# Altium project mini_backplane.PrjPcb
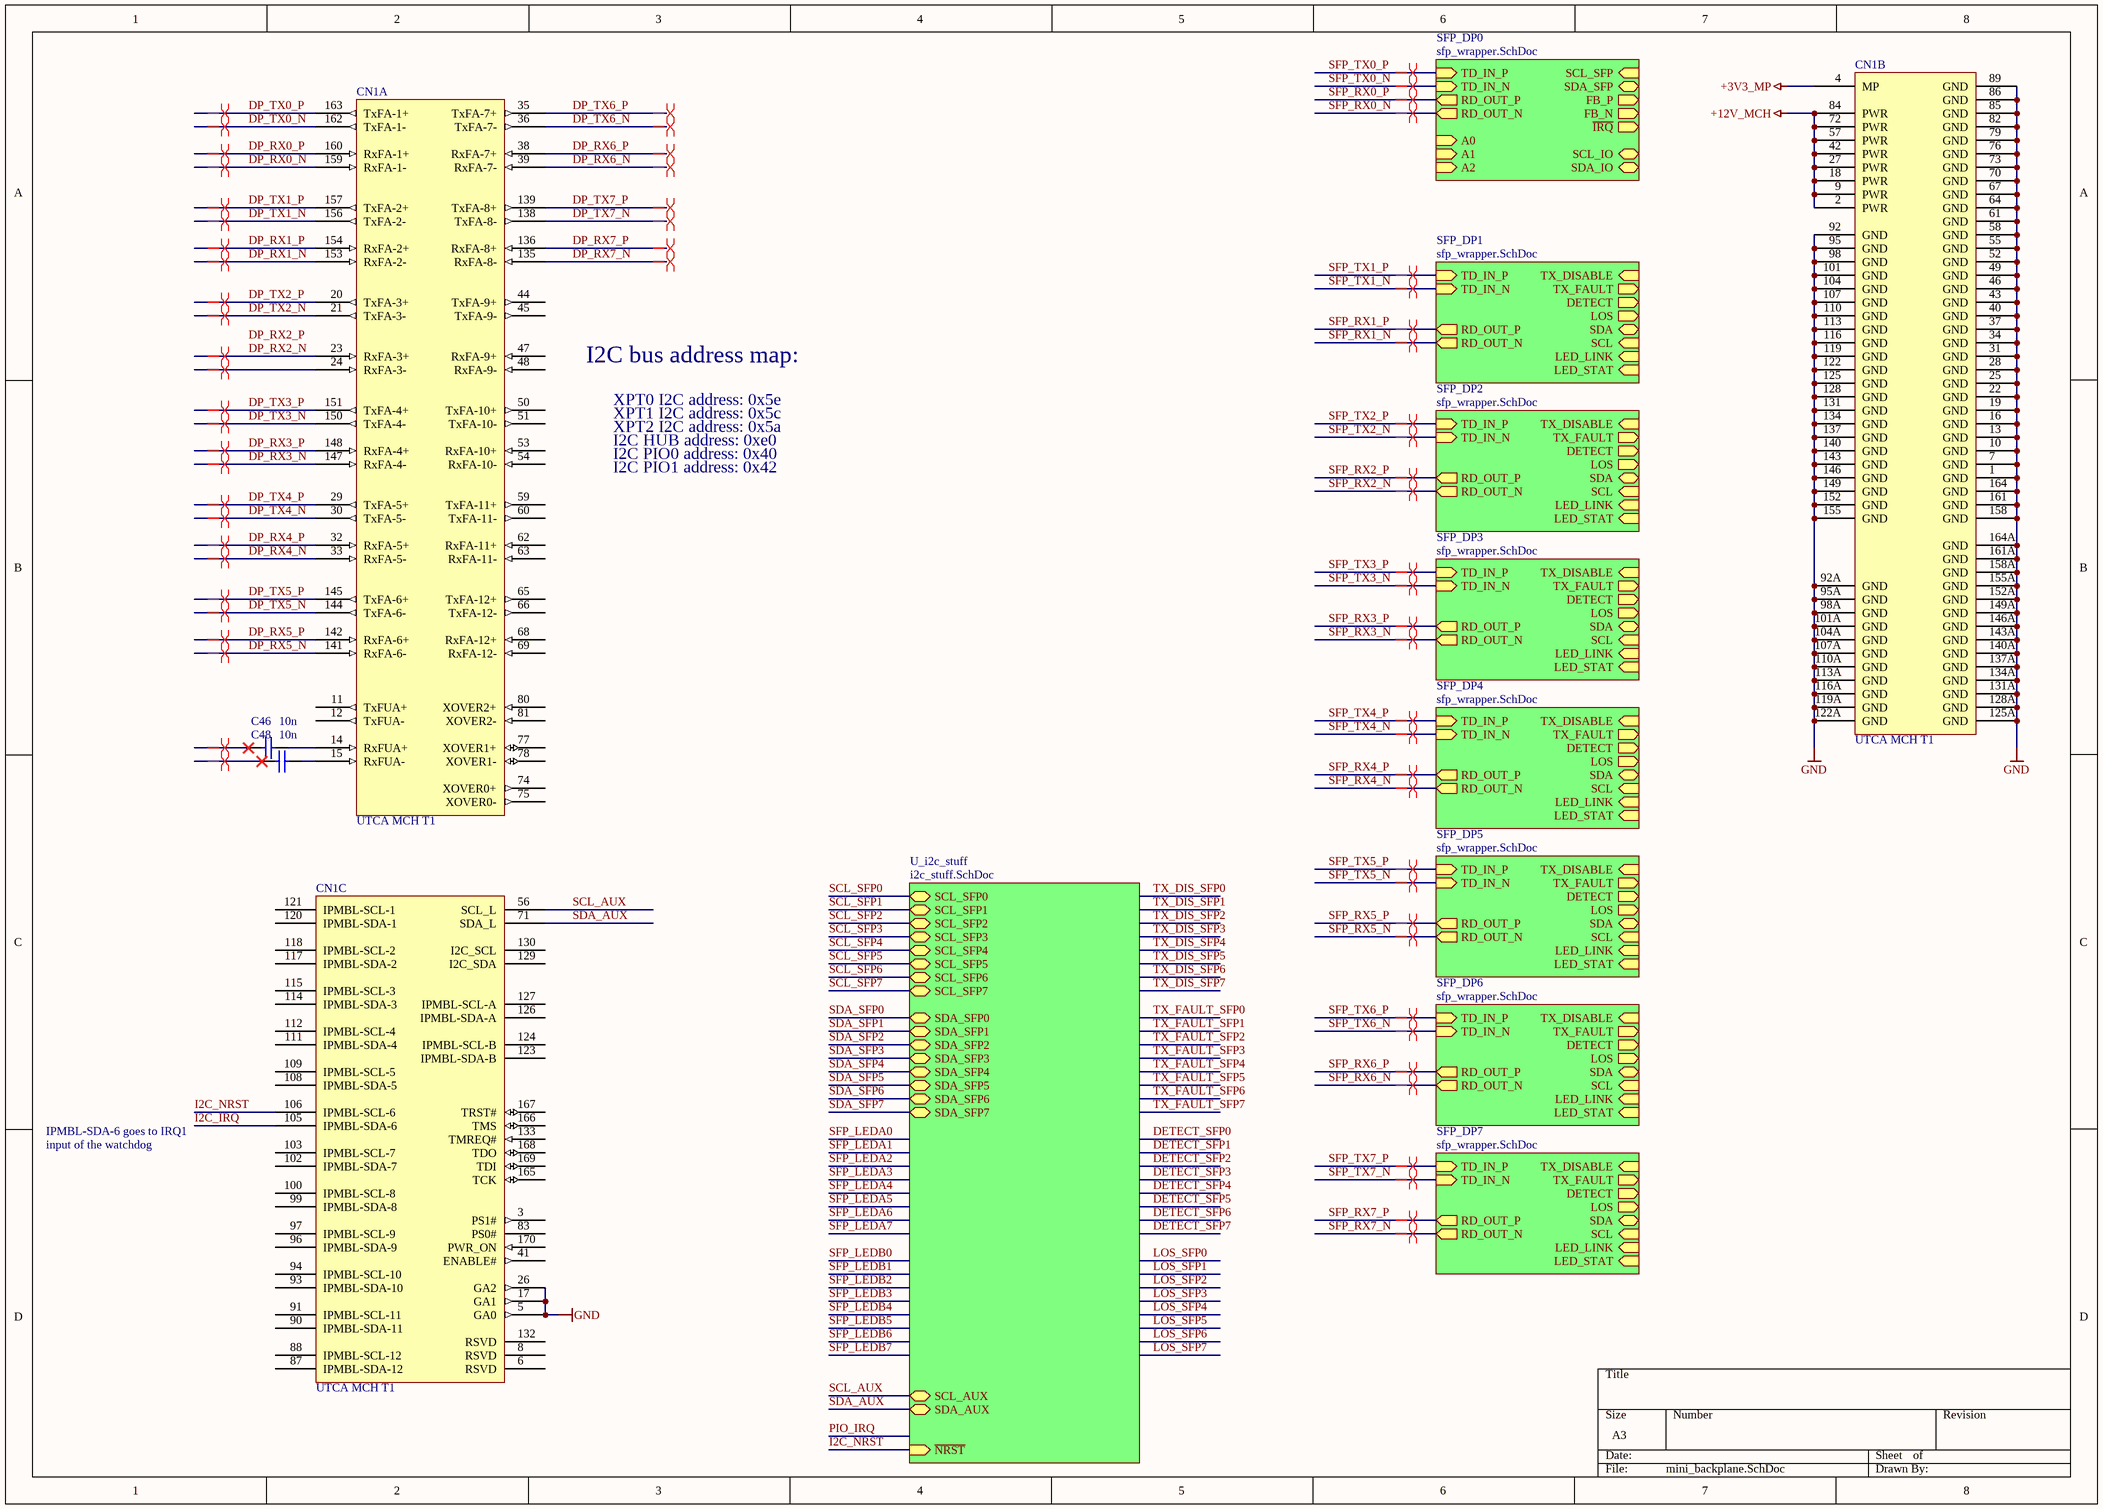
[diagram p0: mini_backplane.SchDoc]
4 sheets, 284 parts. Net scope: hierarchical (ports join the sheet entries above them; power ports are global).
Board file: mini_backplane.PcbDoc
Sheets:
  mini_backplane.SchDoc
    SFP_DP0 = sfp_wrapper.SchDoc
    SFP_DP1 = sfp_wrapper.SchDoc
    SFP_DP2 = sfp_wrapper.SchDoc
    SFP_DP3 = sfp_wrapper.SchDoc
    SFP_DP4 = sfp_wrapper.SchDoc
    SFP_DP5 = sfp_wrapper.SchDoc
    SFP_DP6 = sfp_wrapper.SchDoc
    SFP_DP7 = sfp_wrapper.SchDoc
    U_i2c_stuff = i2c_stuff.SchDoc
  xpoint.SchDoc

## Sheet mini_backplane.SchDoc
size A3

### Parts
C46  10n  [CAPC1608X87N]
C48  10n  [CAPC1608X87N]
CN1  UTCA MCH T1  [CON_AMC_MOLEX_75800_00001_REVERSE]  (parts A,B,C of 3)

### Sub-sheets
SFP_DP0 = sfp_wrapper.SchDoc: RD_OUT_N (out), RD_OUT_P (out), TD_IN_N (in), TD_IN_P (in), SDA_SFP (bidir), SCL_SFP (in), FB_P (out), FB_N (out), ~{IRQ} (out), A0 (in), A1 (in), A2 (in), SCL_IO (bidir), SDA_IO (bidir)
SFP_DP1 = sfp_wrapper.SchDoc: TX_FAULT (out), TX_DISABLE (in), SDA (bidir), SCL (in), DETECT (out), LOS (out), RD_OUT_N (out), RD_OUT_P (out), TD_IN_N (in), TD_IN_P (in), LED_LINK (in), LED_STAT (in)
SFP_DP2 = sfp_wrapper.SchDoc: TX_FAULT (out), TX_DISABLE (in), SDA (bidir), SCL (in), DETECT (out), LOS (out), RD_OUT_N (out), RD_OUT_P (out), TD_IN_N (in), TD_IN_P (in), LED_LINK (in), LED_STAT (in)
SFP_DP3 = sfp_wrapper.SchDoc: TX_FAULT (out), TX_DISABLE (in), SDA (bidir), SCL (in), DETECT (out), LOS (out), RD_OUT_N (out), RD_OUT_P (out), TD_IN_N (in), TD_IN_P (in), LED_LINK (in), LED_STAT (in)
SFP_DP4 = sfp_wrapper.SchDoc: TX_FAULT (out), TX_DISABLE (in), SDA (bidir), SCL (in), DETECT (out), LOS (out), RD_OUT_N (out), RD_OUT_P (out), TD_IN_N (in), TD_IN_P (in), LED_LINK (in), LED_STAT (in)
SFP_DP5 = sfp_wrapper.SchDoc: TX_FAULT (out), TX_DISABLE (in), SDA (bidir), SCL (in), DETECT (out), LOS (out), RD_OUT_N (out), RD_OUT_P (out), TD_IN_N (in), TD_IN_P (in), LED_LINK (in), LED_STAT (in)
SFP_DP6 = sfp_wrapper.SchDoc: TX_FAULT (out), TX_DISABLE (in), SDA (bidir), SCL (in), DETECT (out), LOS (out), RD_OUT_N (out), RD_OUT_P (out), TD_IN_N (in), TD_IN_P (in), LED_LINK (in), LED_STAT (in)
SFP_DP7 = sfp_wrapper.SchDoc: TX_FAULT (out), TX_DISABLE (in), SDA (bidir), SCL (in), DETECT (out), LOS (out), RD_OUT_N (out), RD_OUT_P (out), TD_IN_N (in), TD_IN_P (in), LED_LINK (in), LED_STAT (in)
U_i2c_stuff = i2c_stuff.SchDoc: SCL_SFP0 (bidir), SCL_SFP1 (bidir), SCL_SFP2 (bidir), SCL_SFP3 (bidir), SCL_SFP4 (bidir), SCL_SFP5 (bidir), SCL_SFP6 (bidir), SCL_SFP7 (bidir), SDA_SFP0 (bidir), SDA_SFP1 (bidir), SDA_SFP2 (bidir), SDA_SFP3 (bidir), SDA_SFP4 (bidir), SDA_SFP5 (bidir), SDA_SFP6 (bidir), SDA_SFP7 (bidir), SCL_AUX (bidir), SDA_AUX (bidir), ~{NRST} (in)

### Nets
+3V3_MP: CN1.4(MP)
+12V_MCH: CN1.2(PWR) CN1.9(PWR) CN1.18(PWR) CN1.27(PWR) CN1.42(PWR) CN1.57(PWR) CN1.72(PWR) CN1.84(PWR)
GND: CN1.1(GND) CN1.5(GA0) CN1.7(GND) CN1.10(GND) CN1.13(GND) CN1.16(GND) CN1.17(GA1) CN1.19(GND) CN1.22(GND) CN1.25(GND) CN1.26(GA2) CN1.28(GND) CN1.31(GND) CN1.34(GND) CN1.37(GND) CN1.40(GND) CN1.43(GND) CN1.46(GND) CN1.49(GND) CN1.52(GND) CN1.55(GND) CN1.58(GND) CN1.61(GND) CN1.64(GND) CN1.67(GND) CN1.70(GND) CN1.73(GND) CN1.76(GND) CN1.79(GND) CN1.82(GND) CN1.85(GND) CN1.86(GND) CN1.89(GND) CN1.92(GND) CN1.92A(GND) CN1.95(GND) CN1.95A(GND) CN1.98(GND) CN1.98A(GND) CN1.101(GND) CN1.101A(GND) CN1.104(GND) CN1.104A(GND) CN1.107(GND) CN1.107A(GND) CN1.110(GND) CN1.110A(GND) CN1.113(GND) CN1.113A(GND) CN1.116(GND) CN1.116A(GND) CN1.119(GND) CN1.119A(GND) CN1.122(GND) CN1.122A(GND) CN1.125(GND) CN1.125A(GND) CN1.128(GND) CN1.128A(GND) CN1.131(GND) CN1.131A(GND) CN1.134(GND) CN1.134A(GND) CN1.137(GND) CN1.137A(GND) CN1.140(GND) CN1.140A(GND) CN1.143(GND) CN1.143A(GND) CN1.146(GND) CN1.146A(GND) CN1.149(GND) CN1.149A(GND) CN1.152(GND) CN1.152A(GND) CN1.155(GND) CN1.155A(GND) CN1.158(GND) CN1.158A(GND) CN1.161(GND) CN1.161A(GND) CN1.164(GND) CN1.164A(GND)
DP_RX0_N: CN1.159(RxFA-1-)
DP_RX0_P: CN1.160(RxFA-1+)
DP_RX1_N: CN1.153(RxFA-2-)
DP_RX1_P: CN1.154(RxFA-2+)
DP_RX2_N: CN1.23(RxFA-3+)
DP_RX3_N: CN1.147(RxFA-4-)
DP_RX3_P: CN1.148(RxFA-4+)
DP_RX4_N: CN1.33(RxFA-5-)
DP_RX4_P: CN1.32(RxFA-5+)
DP_RX5_N: CN1.141(RxFA-6-)
DP_RX5_P: CN1.142(RxFA-6+)
DP_RX6_N: CN1.39(RxFA-7-)
DP_RX6_P: CN1.38(RxFA-7+)
DP_RX7_N: CN1.135(RxFA-8-)
DP_RX7_P: CN1.136(RxFA-8+)
DP_TX0_N: CN1.162(TxFA-1-)
DP_TX0_P: CN1.163(TxFA-1+)
DP_TX1_N: CN1.156(TxFA-2-)
DP_TX1_P: CN1.157(TxFA-2+)
DP_TX2_N: CN1.21(TxFA-3-)
DP_TX2_P: CN1.20(TxFA-3+)
DP_TX3_N: CN1.150(TxFA-4-)
DP_TX3_P: CN1.151(TxFA-4+)
DP_TX4_N: CN1.30(TxFA-5-)
DP_TX4_P: CN1.29(TxFA-5+)
DP_TX5_N: CN1.144(TxFA-6-)
DP_TX5_P: CN1.145(TxFA-6+)
DP_TX6_N: CN1.36(TxFA-7-)
DP_TX6_P: CN1.35(TxFA-7+)
DP_TX7_N: CN1.138(TxFA-8-)
DP_TX7_P: CN1.139(TxFA-8+)
I2C_IRQ: CN1.105(IPMBL-SDA-6)
I2C_NRST: CN1.106(IPMBL-SCL-6) ; sheet U_i2c_stuff/~{NRST}
SCL_AUX: CN1.56(SCL_L) ; sheet U_i2c_stuff/SCL_AUX
SDA_AUX: CN1.71(SDA_L) ; sheet U_i2c_stuff/SDA_AUX
SDA_SFP7: sheet U_i2c_stuff/SDA_SFP7
NetC46_2: C46.2 CN1.14(RxFUA+)
NetC48_2: C48.2 CN1.15(RxFUA-)

Not connected (* = marked no-connect by the designer): C46 1*; C48 1*; CN1 3(PS1#) 6(RSVD) 8(RSVD) 11(TxFUA+) 12(TxFUA-) 24(RxFA-3-) 41(ENABLE#) 44(TxFA-9+) 45(TxFA-9-) 47(RxFA-9+) 48(RxFA-9-) 50(TxFA-10+) 51(TxFA-10-) 53(RxFA-10+) 54(RxFA-10-) 59(TxFA-11+) 60(TxFA-11-) 62(RxFA-11+) 63(RxFA-11-) 65(TxFA-12+) 66(TxFA-12-) 68(RxFA-12+) 69(RxFA-12-) 74(XOVER0+) 75(XOVER0-) 77(XOVER1+) 78(XOVER1-) 80(XOVER2+) 81(XOVER2-) 83(PS0#) 87(IPMBL-SDA-12) 88(IPMBL-SCL-12) 90(IPMBL-SDA-11) 91(IPMBL-SCL-11) 93(IPMBL-SDA-10) 94(IPMBL-SCL-10) 96(IPMBL-SDA-9) 97(IPMBL-SCL-9) 99(IPMBL-SDA-8) 100(IPMBL-SCL-8) 102(IPMBL-SDA-7) 103(IPMBL-SCL-7) 108(IPMBL-SDA-5) 109(IPMBL-SCL-5) 111(IPMBL-SDA-4) 112(IPMBL-SCL-4) 114(IPMBL-SDA-3) 115(IPMBL-SCL-3) 117(IPMBL-SDA-2) 118(IPMBL-SCL-2) 120(IPMBL-SDA-1) 121(IPMBL-SCL-1) 123(IPMBL-SDA-B) 124(IPMBL-SCL-B) 126(IPMBL-SDA-A) 127(IPMBL-SCL-A) 129(I2C_SDA) 130(I2C_SCL) 132(RSVD) 133(TMREQ#) 165(TCK) 166(TMS) 167(TRST#) 168(TDO) 169(TDI) 170(PWR_ON)

### Layout directives
differential pair: DP_RX0_N, DP_RX0_P, DP_RX1_N, DP_RX1_P, DP_RX2_N, DP_RX3_N, DP_RX3_P, DP_RX4_N, DP_RX4_P, DP_RX5_N, DP_RX5_P, DP_RX6_N, DP_RX6_P, DP_RX7_N, DP_RX7_P, DP_TX0_N, DP_TX0_P, DP_TX1_N, DP_TX1_P, DP_TX2_N, DP_TX2_P, DP_TX3_N, DP_TX3_P, DP_TX4_N, DP_TX4_P, DP_TX5_N, DP_TX5_P, DP_TX6_N, DP_TX6_P, DP_TX7_N, DP_TX7_P, NetC46_1, NetC48_1, NetCN1_24, RD_OUT_N_SFP_DP0, RD_OUT_N_SFP_DP1, RD_OUT_N_SFP_DP2, RD_OUT_N_SFP_DP3, RD_OUT_N_SFP_DP4, RD_OUT_N_SFP_DP5, RD_OUT_N_SFP_DP6, RD_OUT_N_SFP_DP7, RD_OUT_P_SFP_DP0, RD_OUT_P_SFP_DP1, RD_OUT_P_SFP_DP2, RD_OUT_P_SFP_DP3, RD_OUT_P_SFP_DP4, RD_OUT_P_SFP_DP5, RD_OUT_P_SFP_DP6, RD_OUT_P_SFP_DP7, SFP_TX0_N, SFP_TX0_P, SFP_TX1_N, SFP_TX1_P, SFP_TX2_N, SFP_TX2_P, SFP_TX3_N, SFP_TX3_P, SFP_TX4_N, SFP_TX4_P, SFP_TX5_N, SFP_TX5_P, SFP_TX6_N, SFP_TX6_P, SFP_TX7_N, SFP_TX7_P

### Notes on the sheet
- I2C bus address map:
- XPT0 I2C address: 0x5e
- XPT1 I2C address: 0x5c
- XPT2 I2C address: 0x5a
- I2C HUB address: 0xe0
- I2C PIO0 address: 0x40
- I2C PIO1 address: 0x42
- IPMBL-SDA-6 goes to IRQ1
- input of the watchdog
- Labels drawn without touching a wire or pin: DP_RX2_P

### Library data of the parts
C46 C48 = CC0603_10NF_50V_10%_X7R: Non-polarised capacitor; Part Description: SMD Multilayer Chip Ceramic Capacitor; Manufacturer: GENERIC; Manufacturer1 Part Number: 223858615636; Value: 10nF; Voltage: 50V; TC: X7R; Tolerance: ±10%; Table: Capacitors SMD; Part Number: CC0603_10NF_50V_10%_X7R; Component Kind: Standard; Component Type: Standard; Pin Count: 2; Status: Preferred; Manufacturer Part Number: CC0603_10NF_50V_10%_X7R; Case: 0603; Mounted: Yes; Socket: No; SMD: Yes; Manufacturer1 Example: PHYCOMP; Manufacturer1 ComponentHeight: 0.87mm; HelpURL: \\cern.ch\dfs\Applications\Altium\Datasheets\CC0603_X7R_PHYCOMP.pdf; Author: CERN DEM JLC; CreateDate: 12/3/2007; LatestRevisionDate: 12/3/2007
CN1 = UTCA_MCH_SOCKET: microTCA MTCA.0  MCH socket (AMC0.0 B+ connector with reversed pins); Value: MCH tongue 1; Value: MOLEX 75800-00001; RefId: 1353569; Supplier: Farnell

## Sheet sfp_wrapper.SchDoc
size A4
Used 8 times, as channels SFP_DP0, SFP_DP1, SFP_DP2, SFP_DP3, SFP_DP4, SFP_DP5, SFP_DP6, SFP_DP7. Parts and nets are listed once, with the designators drawn on the sheet.
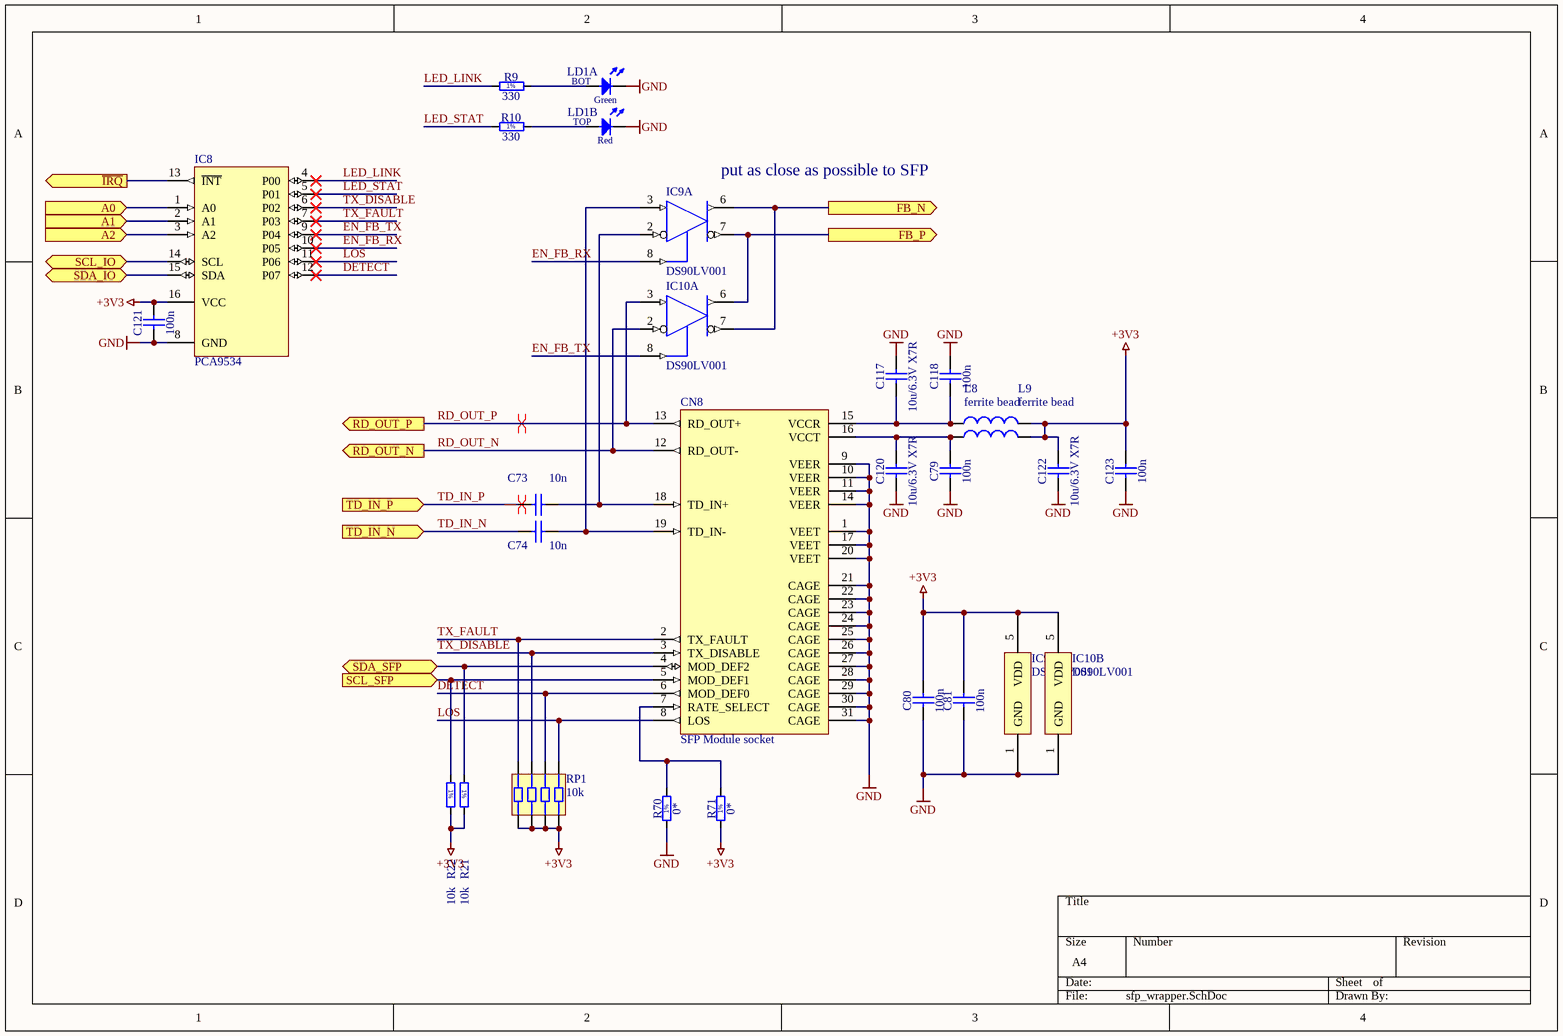
[diagram p1: sfp_wrapper.SchDoc]

### Parts
C73  10n  [CAPC1608X87N]
C74  10n  [CAPC1608X87N]
C79  100n  [CAPC1608X87N]
C80  100n  [CAPC1608X87N]
C81  100n  [CAPC1608X87N]
C117  10u/6.3V X7R  [CAPC3216X140N]
C118  100n  [CAPC1608X87N]
C120  10u/6.3V X7R  [CAPC3216X140N]
C121  100n  [CAPC1608X87N]
C122  10u/6.3V X7R  [CAPC3216X140N]
C123  100n  [CAPC1608X87N]
CN8  SFP Module socket  [SFP_SINGLE_PORT]
IC8  PCA9534  [TSOP65P640-16AM]
IC9  DS90LV001  [SOIC127P600-8AL]  (parts A,B of 2)
IC10  DS90LV001  [SOIC127P600-8AL]  (parts A,B of 2)
L8  value ferrite bead  [INDC2012-0805]  (hidden comment: Inductor)
L9  value ferrite bead  [INDC2012-0805]  (hidden comment: Inductor)
LD1  Red/Green  [LED_DIALIGHT_571-0112-100F]  (value not drawn)  (parts A,B of 2)
R9  330  [RESC1608X55N]
R10  330  [RESC1608X55N]
R21  10k  [RESC1608X55N]
R22  10k  [RESC1608X55N]
R70  0*  [RESC1608X55N]
R71  0*  [RESC1608X55N]
RP1  10k  [CAY-16]

### Ports
A0 (in), A1 (in), A2 (in), FB_N (out), FB_P (out), RD_OUT_N (out), RD_OUT_P (out), SCL_IO (bidir), SCL_SFP (in), SDA_IO (bidir), SDA_SFP (bidir), TD_IN_N (in), TD_IN_P (in), ~{IRQ} (out)

### Nets
+3V3: C80.2 C81.2 C121.2 C122.2 C123.2 IC8.16(VCC) IC9.5(VDD) IC10.5(VDD) L8.2 L9.2 R21.2 R22.2 R71.1 RP1.1 RP1.2 RP1.3 RP1.4
GND: C79.1 C80.1 C81.1 C117.2 C118.2 C120.1 C121.1 C122.1 C123.1 CN8.1(VEET) CN8.9(VEER) CN8.10(VEER) CN8.11(VEER) CN8.14(VEER) CN8.17(VEET) CN8.20(VEET) CN8.21(CAGE) CN8.22(CAGE) CN8.23(CAGE) CN8.24(CAGE) CN8.25(CAGE) CN8.26(CAGE) CN8.27(CAGE) CN8.28(CAGE) CN8.29(CAGE) CN8.30(CAGE) CN8.31(CAGE) IC8.8(GND) IC9.1(GND) IC10.1(GND) LD1.1(C) LD1.3(C) R70.1
A0: IC8.1(A0) ; port A0
A1: IC8.2(A1) ; port A1
A2: IC8.3(A2) ; port A2
DETECT: CN8.6(MOD_DEF0) IC8.12(P07) RP1.6
EN_FB_RX: IC8.10(P05) IC9.8(EN)
EN_FB_TX: IC8.9(P04) IC10.8(EN)
FB_N: IC9.6(OUT+) IC10.7(OUT-) ; port FB_N
FB_P: IC9.7(OUT-) IC10.6(OUT+) ; port FB_P
~{IRQ}: IC8.13(~{INT}) ; port ~{IRQ}
LED_LINK: IC8.4(P00) R9.1
LED_STAT: IC8.5(P01) R10.1
LOS: CN8.8(LOS) IC8.11(P06) RP1.5
RD_OUT_N: CN8.12(RD_OUT-) IC10.2(IN-) ; port RD_OUT_N
RD_OUT_P: CN8.13(RD_OUT+) IC10.3(IN+) ; port RD_OUT_P
SCL_IO: IC8.14(SCL) ; port SCL_IO
SCL_SFP: CN8.5(MOD_DEF1) R22.1 ; port SCL_SFP
SDA_IO: IC8.15(SDA) ; port SDA_IO
SDA_SFP: CN8.4(MOD_DEF2) R21.1 ; port SDA_SFP
TD_IN_N: C74.1 ; port TD_IN_N
TD_IN_P: C73.1 ; port TD_IN_P
TX_DISABLE: CN8.3(TX_DISABLE) IC8.6(P02) RP1.7
TX_FAULT: CN8.2(TX_FAULT) IC8.7(P03) RP1.8
NetC73_2: C73.2 CN8.18(TD_IN+) IC9.2(IN-)
NetC74_2: C74.2 CN8.19(TD_IN-) IC9.3(IN+)
NetC79_2: C79.2 C120.2 CN8.16(VCCT) L8.1
NetC117_1: C117.1 C118.1 CN8.15(VCCR) L9.1
NetCN8_7: CN8.7(RATE_SELECT) R70.2 R71.2
NetLD1_2: LD1.2(A) R9.2
NetLD1_4: LD1.4(A) R10.2

### Channels
SFP_DP0: designators end in _SFP_DP0; ports A0=NetIC8_SFP_DP0_1 A1=NetIC8_SFP_DP0_2 A2=NetIC8_SFP_DP0_3 FB_N=NetIC9_SFP_DP0_6 FB_P=NetIC9_SFP_DP0_7 RD_OUT_N=RD_OUT_N_SFP_DP0 RD_OUT_P=RD_OUT_P_SFP_DP0 SCL_IO=NetIC8_SFP_DP0_14 SCL_SFP=NetCN8_SFP_DP0_5 SDA_IO=NetIC8_SFP_DP0_15 SDA_SFP=NetCN8_SFP_DP0_4 TD_IN_N=SFP_TX0_N TD_IN_P=SFP_TX0_P ~{IRQ}=NetIC8_SFP_DP0_13
SFP_DP1: designators end in _SFP_DP1; ports A0=NetIC8_SFP_DP1_1 A1=NetIC8_SFP_DP1_2 A2=NetIC8_SFP_DP1_3 FB_N=NetIC9_SFP_DP1_6 FB_P=NetIC9_SFP_DP1_7 RD_OUT_N=RD_OUT_N_SFP_DP1 RD_OUT_P=RD_OUT_P_SFP_DP1 SCL_IO=NetIC8_SFP_DP1_14 SCL_SFP=NetCN8_SFP_DP1_5 SDA_IO=NetIC8_SFP_DP1_15 SDA_SFP=NetCN8_SFP_DP1_4 TD_IN_N=SFP_TX1_N TD_IN_P=SFP_TX1_P ~{IRQ}=NetIC8_SFP_DP1_13
SFP_DP2: designators end in _SFP_DP2; ports A0=NetIC8_SFP_DP2_1 A1=NetIC8_SFP_DP2_2 A2=NetIC8_SFP_DP2_3 FB_N=NetIC9_SFP_DP2_6 FB_P=NetIC9_SFP_DP2_7 RD_OUT_N=RD_OUT_N_SFP_DP2 RD_OUT_P=RD_OUT_P_SFP_DP2 SCL_IO=NetIC8_SFP_DP2_14 SCL_SFP=NetCN8_SFP_DP2_5 SDA_IO=NetIC8_SFP_DP2_15 SDA_SFP=NetCN8_SFP_DP2_4 TD_IN_N=SFP_TX2_N TD_IN_P=SFP_TX2_P ~{IRQ}=NetIC8_SFP_DP2_13
SFP_DP3: designators end in _SFP_DP3; ports A0=NetIC8_SFP_DP3_1 A1=NetIC8_SFP_DP3_2 A2=NetIC8_SFP_DP3_3 FB_N=NetIC9_SFP_DP3_6 FB_P=NetIC9_SFP_DP3_7 RD_OUT_N=RD_OUT_N_SFP_DP3 RD_OUT_P=RD_OUT_P_SFP_DP3 SCL_IO=NetIC8_SFP_DP3_14 SCL_SFP=NetCN8_SFP_DP3_5 SDA_IO=NetIC8_SFP_DP3_15 SDA_SFP=NetCN8_SFP_DP3_4 TD_IN_N=SFP_TX3_N TD_IN_P=SFP_TX3_P ~{IRQ}=NetIC8_SFP_DP3_13
SFP_DP4: designators end in _SFP_DP4; ports A0=NetIC8_SFP_DP4_1 A1=NetIC8_SFP_DP4_2 A2=NetIC8_SFP_DP4_3 FB_N=NetIC9_SFP_DP4_6 FB_P=NetIC9_SFP_DP4_7 RD_OUT_N=RD_OUT_N_SFP_DP4 RD_OUT_P=RD_OUT_P_SFP_DP4 SCL_IO=NetIC8_SFP_DP4_14 SCL_SFP=NetCN8_SFP_DP4_5 SDA_IO=NetIC8_SFP_DP4_15 SDA_SFP=NetCN8_SFP_DP4_4 TD_IN_N=SFP_TX4_N TD_IN_P=SFP_TX4_P ~{IRQ}=NetIC8_SFP_DP4_13
SFP_DP5: designators end in _SFP_DP5; ports A0=NetIC8_SFP_DP5_1 A1=NetIC8_SFP_DP5_2 A2=NetIC8_SFP_DP5_3 FB_N=NetIC9_SFP_DP5_6 FB_P=NetIC9_SFP_DP5_7 RD_OUT_N=RD_OUT_N_SFP_DP5 RD_OUT_P=RD_OUT_P_SFP_DP5 SCL_IO=NetIC8_SFP_DP5_14 SCL_SFP=NetCN8_SFP_DP5_5 SDA_IO=NetIC8_SFP_DP5_15 SDA_SFP=NetCN8_SFP_DP5_4 TD_IN_N=SFP_TX5_N TD_IN_P=SFP_TX5_P ~{IRQ}=NetIC8_SFP_DP5_13
SFP_DP6: designators end in _SFP_DP6; ports A0=NetIC8_SFP_DP6_1 A1=NetIC8_SFP_DP6_2 A2=NetIC8_SFP_DP6_3 FB_N=NetIC9_SFP_DP6_6 FB_P=NetIC9_SFP_DP6_7 RD_OUT_N=RD_OUT_N_SFP_DP6 RD_OUT_P=RD_OUT_P_SFP_DP6 SCL_IO=NetIC8_SFP_DP6_14 SCL_SFP=NetCN8_SFP_DP6_5 SDA_IO=NetIC8_SFP_DP6_15 SDA_SFP=NetCN8_SFP_DP6_4 TD_IN_N=SFP_TX6_N TD_IN_P=SFP_TX6_P ~{IRQ}=NetIC8_SFP_DP6_13
SFP_DP7: designators end in _SFP_DP7; ports A0=NetIC8_SFP_DP7_1 A1=NetIC8_SFP_DP7_2 A2=NetIC8_SFP_DP7_3 FB_N=NetIC9_SFP_DP7_6 FB_P=NetIC9_SFP_DP7_7 RD_OUT_N=RD_OUT_N_SFP_DP7 RD_OUT_P=RD_OUT_P_SFP_DP7 SCL_IO=NetIC8_SFP_DP7_14 SCL_SFP=NetCN8_SFP_DP7_5 SDA_IO=NetIC8_SFP_DP7_15 SDA_SFP=NetCN8_SFP_DP7_4 TD_IN_N=SFP_TX7_N TD_IN_P=SFP_TX7_P ~{IRQ}=NetIC8_SFP_DP7_13

### Layout directives
differential pair: RD_OUT_P_SFP_DP0, SFP_TX0_P

### Notes on the sheet
- (near IC9) put as close as possible to SFP
- (in symbol LED_DIALIGHT_571-0112-100F, part A) BOT; Green
- (in symbol LED_DIALIGHT_571-0112-100F, part B) TOP; Red
- (in symbol R0603_0R_JUMPER) 1%
- (in symbol R0603_10K_1%_0.1W_100PPM) 1%
- (in symbol R0603_330R_1%_0.1W_100PPM) 1%

### Library data of the parts
C73 C74 = CC0603_10NF_50V_10%_X7R: as C46 on sheet mini_backplane; Part Number: CC0603_10NF_50V_10%_X7R; Component Kind: Standard; Component Type: Standard; Pin Count: 2; Status: Preferred; Manufacturer Part Number: CC0603_10NF_50V_10%_X7R; Case: 0603; Mounted: Yes; Socket: No; SMD: Yes; Manufacturer1 Example: PHYCOMP; Manufacturer1 ComponentHeight: 0.87mm; HelpURL: \\cern.ch\dfs\Applications\Altium\Datasheets\CC0603_X7R_PHYCOMP.pdf; Author: CERN DEM JLC; CreateDate: 12/3/2007; LatestRevisionDate: 12/3/2007
C79-C81 C118 C121 C123 = CC0603_100NF_50V_10%_X7R: Non-polarised capacitor; Part Description: SMD Multilayer Chip Ceramic Capacitor; Manufacturer: GENERIC; Manufacturer1 Part Number: 223858615649; Manufacturer1 Datasheet: \\cern.ch\dfs\Applications\Altium\Datasheets\CC0603_X7R_PHYCOMP.pdf; Value: 100nF; Voltage: 50V; TC: X7R; Tolerance: ±10%; Table: Capacitors SMD; Part Number: CC0603_100NF_50V_10%_X7R; Component Kind: Standard; Component Type: Standard; Designator: Capacitor - non polarized; Library Reference: Capacitor - non polarized; Pin Count: 2; Status: Preferred; Manufacturer Part Number: CC0603_100NF_50V_10%_X7R; Case: 0603; Mounted: Yes; Socket: No; SMD: Yes; Manufacturer1 Example: PHYCOMP; Manufacturer1 ComponentHeight: 0.87mm; HelpURL: \\cern.ch\dfs\Applications\Altium\Datasheets\CC0603_X7R_PHYCOMP.pdf; Author: CERN DEM JLC; CreateDate: 12/3/2007; LatestRevisionDate: 12/3/2007
C117 C120 C122 = CC1206_10UF_10V_10%_X7R: Non-polarised capacitor; Part Description: SMD Multilayer Chip Ceramic Capacitor; Manufacturer: GENERIC; Manufacturer1 Part Number: C1206C106K8RAC; Manufacturer1 Datasheet: \\cern.ch\dfs\Applications\Altium\Datasheets\CC1206_X7R_KEMET.pdf; Value: 10uF; Voltage: 10V; Tolerance: ±10%; Table: Capacitors SMD; Part Number: CC1206_10UF_10V_10%_X7R; Component Kind: Standard; Component Type: Standard; Designator: Capacitor - non polarized; Library Reference: Capacitor - non polarized; Pin Count: 2; Status: Preferred; TC: X7R; Manufacturer Part Number: CC1206_10uF_10V_10%_X7R; Case: 1206; Mounted: Yes; Socket: No; SMD: Yes; Manufacturer1 Example: KEMET; Manufacturer1 ComponentHeight: 1.8mm; HelpURL: \\cern.ch\dfs\Applications\Altium\Datasheets\CC1206_X7R_KEMET.pdf; Author: CERN DEM JLC; CreateDate: 12/3/2007; LatestRevisionDate: 12/3/2007
CN8 = SFP_SOCKET_SINGLE: Socket for SFP module; RefId: Far/1256176
IC8 = PCA9534: 8-bit I2C I/O expander; Value: PCA9534PW; Supplier: Farnell
IC9 IC10 = DS90LV001: LVDS buffer with enable
L8 L9 = Inductor: Ferrite bead; Published: 8-Jun-2000; Revision: July-2002: Re-released for DXP Platform.; Publisher: Altium Limited
LD1 = LED_DIALIGHT_571-0112-100F: 2x LED  Botom Green, Top Red; Part Description: Dual 2mm  LEDs, Red Top,Green Bot, CBI® Circuit Board Indicator (With positioning pins); Table: LEDs & Displays; Part Number: LED_DIALIGHT_571-0112-100F; Component Kind: Standard; Component Type: Standard; Color: Red/Green; PackageDescription: 2x 2mm LED (Top: Red, Bot: Green) PCB Edge Mounting (With positioning pins) DIALIGHT 571 Serie; Manufacturer: DIALIGHT; Manufacturer Part Number: 571-0112-100F; Pin Count: 4; Mounted: Yes; Socket: No; SMD: No; ComponentHeight: 8.6mm; HelpURL: \\cern.ch\dfs\Applications\Altium\Datasheets\LED_DIALIGHT_571-0112-100F.pdf; Author: CERN DEM JLC; CreateDate: 11/5/2009; LatestRevisionDate: 3/17/2010
R9 R10 = R0603_330R_1%_0.1W_100PPM: Resistor - 1%; Part Description: General Purpose Thick Film Chip Resistor; Manufacturer: GENERIC; Manufacturer1 Part Number: NRC06F3300TRF; Power: 0.1W; TC: ±100ppm/°C; Table: Resistors SMD; Part Number: R0603_330R_1%_0.1W_100PPM; Component Kind: Standard; Component Type: Standard; Pin Count: 2; Value: 330; Status: Preferred; Tolerance: ±1%; Manufacturer Part Number: R0603_330R_1%_0.1W_100PPM; Case: 0603; Mounted: Yes; Socket: No; SMD: Yes; Manufacturer1 Example: NIC COMPONENT; Manufacturer1 ComponentHeight: 0.55mm; HelpURL: \\cern.ch\dfs\Applications\Altium\Datasheets\R0603_NIC_NRC.pdf; Author: CERN DEM JLC; CreateDate: 12/3/2007; LatestRevisionDate: 3/13/2008
R21 R22 = R0603_10K_1%_0.1W_100PPM: Resistor - 1%; Part Description: General Purpose Thick Film Chip Resistor; Manufacturer: GENERIC; Manufacturer1 Part Number: NRC06F1002TRF; Power: 0.1W; TC: ±100ppm/°C; Table: Resistors SMD; Part Number: R0603_10K_1%_0.1W_100PPM; Component Kind: Standard; Component Type: Standard; Pin Count: 2; Value: 10k; Status: Preferred; Tolerance: ±1%; Manufacturer Part Number: R0603_10K_1%_0.1W_100PPM; Case: 0603; Mounted: Yes; Socket: No; SMD: Yes; Manufacturer1 Example: NIC COMPONENT; Manufacturer1 ComponentHeight: 0.55mm; HelpURL: \\cern.ch\dfs\Applications\Altium\Datasheets\R0603_NIC_NRC.pdf; Author: CERN DEM JLC; CreateDate: 12/3/2007; LatestRevisionDate: 3/13/2008
R70 R71 = R0603_0R_JUMPER: Resistor - 1%; Part Description: 1A (0.05R Max DC Resistance) Zero Ohm Jumper; Manufacturer: GENERIC; Manufacturer1 Part Number: NRC06Z0; Manufacturer1 Datasheet: \\cern.ch\dfs\Applications\Altium\Datasheets\R0603_NIC_NRC.pdf; Value: 0; Table: Resistors SMD; Part Number: R0603_0R_JUMPER; Component Kind: Standard; Component Type: Standard; Designator: Resistor - 1%; Library Reference: Resistor - 1%; Pin Count: 2; Status: Preferred; Manufacturer Part Number: R0603_0R_JUMPER; Case: 0603; Mounted: Yes; Socket: No; SMD: Yes; Manufacturer1 Example: NIC COMPONENT; Manufacturer1 ComponentHeight: 0.55mm; HelpURL: \\cern.ch\dfs\Applications\Altium\Datasheets\R0603_NIC_NRC.pdf; Author: CERN DEM JLC; CreateDate: 12/3/2007; LatestRevisionDate: 3/13/2008
RP1 = RES_ARRAY_1206: Resistor network 1206 (4x0402) Maritex RAC4Xxxx

## Sheet i2c_stuff.SchDoc
size A4
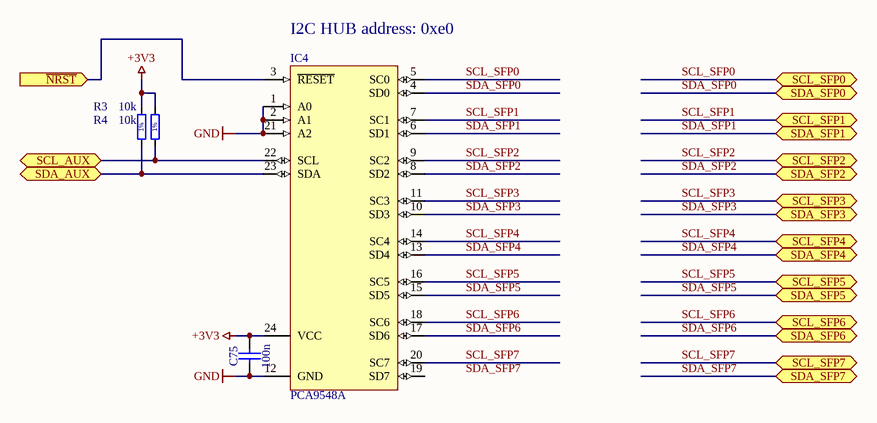
[diagram p2: i2c_stuff.SchDoc]

### Parts
C75  100n  [CAPC1608X87N]
IC4  PCA9548A  [TSOP65P640-24AL]
R3  10k  [RESC1608X55N]
R4  10k  [RESC1608X55N]

### Ports
SCL_AUX (bidir), SCL_SFP0 (bidir), SCL_SFP1 (bidir), SCL_SFP2 (bidir), SCL_SFP3 (bidir), SCL_SFP4 (bidir), SCL_SFP5 (bidir), SCL_SFP6 (bidir), SCL_SFP7 (bidir), SDA_AUX (bidir), SDA_SFP0 (bidir), SDA_SFP1 (bidir), SDA_SFP2 (bidir), SDA_SFP3 (bidir), SDA_SFP4 (bidir), SDA_SFP5 (bidir), SDA_SFP6 (bidir), SDA_SFP7 (bidir), ~{NRST} (in)

### Nets
+3V3: C75.2 IC4.24(VCC) R3.2 R4.2
GND: C75.1 IC4.1(A0) IC4.2(A1) IC4.12(GND) IC4.21(A2)
I2C_NRST: IC4.3(~{RESET}) ; port ~{NRST}
SCL_AUX: IC4.22(SCL) R3.1 ; port SCL_AUX
SCL_SFP0: IC4.5(SC0) ; port SCL_SFP0
SCL_SFP1: IC4.7(SC1) ; port SCL_SFP1
SCL_SFP2: IC4.9(SC2) ; port SCL_SFP2
SCL_SFP3: IC4.11(SC3) ; port SCL_SFP3
SCL_SFP4: IC4.14(SC4) ; port SCL_SFP4
SCL_SFP5: IC4.16(SC5) ; port SCL_SFP5
SCL_SFP6: IC4.18(SC6) ; port SCL_SFP6
SCL_SFP7: IC4.20(SC7) ; port SCL_SFP7
SDA_AUX: IC4.23(SDA) R4.1 ; port SDA_AUX
SDA_SFP0: IC4.4(SD0) ; port SDA_SFP0
SDA_SFP1: IC4.6(SD1) ; port SDA_SFP1
SDA_SFP2: IC4.8(SD2) ; port SDA_SFP2
SDA_SFP3: IC4.10(SD3) ; port SDA_SFP3
SDA_SFP4: IC4.13(SD4) ; port SDA_SFP4
SDA_SFP5: IC4.15(SD5) ; port SDA_SFP5
SDA_SFP6: IC4.17(SD6) ; port SDA_SFP6
SDA_SFP7: port SDA_SFP7

Not connected (* = marked no-connect by the designer): IC4 19(SD7)

### Notes on the sheet
- (near IC4) I2C HUB address: 0xe0
- Labels drawn without touching a wire or pin: SDA_SFP7
- (in symbol R0603_10K_1%_0.1W_100PPM) 1%

### Library data of the parts
C75 = CC0603_100NF_50V_10%_X7R: as C79 on sheet sfp_wrapper; Part Number: CC0603_100NF_50V_10%_X7R; Component Kind: Standard; Component Type: Standard; Designator: Capacitor - non polarized; Library Reference: Capacitor - non polarized; Pin Count: 2; Status: Preferred; Manufacturer Part Number: CC0603_100NF_50V_10%_X7R; Case: 0603; Mounted: Yes; Socket: No; SMD: Yes; Manufacturer1 Example: PHYCOMP; Manufacturer1 ComponentHeight: 0.87mm; HelpURL: \\cern.ch\dfs\Applications\Altium\Datasheets\CC0603_X7R_PHYCOMP.pdf; Author: CERN DEM JLC; CreateDate: 12/3/2007; LatestRevisionDate: 12/3/2007
IC4 = PCA9548A: 1-to-8 I2C bus mux; RefId: 1607855; Value: PCA9548APWR; Supplier: Farnell
R3 R4 = R0603_10K_1%_0.1W_100PPM: as R21 on sheet sfp_wrapper; Part Number: R0603_10K_1%_0.1W_100PPM; Component Kind: Standard; Component Type: Standard; Pin Count: 2; Value: 10k; Status: Preferred; Tolerance: ±1%; Manufacturer Part Number: R0603_10K_1%_0.1W_100PPM; Case: 0603; Mounted: Yes; Socket: No; SMD: Yes; Manufacturer1 Example: NIC COMPONENT; Manufacturer1 ComponentHeight: 0.55mm; HelpURL: \\cern.ch\dfs\Applications\Altium\Datasheets\R0603_NIC_NRC.pdf; Author: CERN DEM JLC; CreateDate: 12/3/2007; LatestRevisionDate: 3/13/2008

## Sheet xpoint.SchDoc
size A3
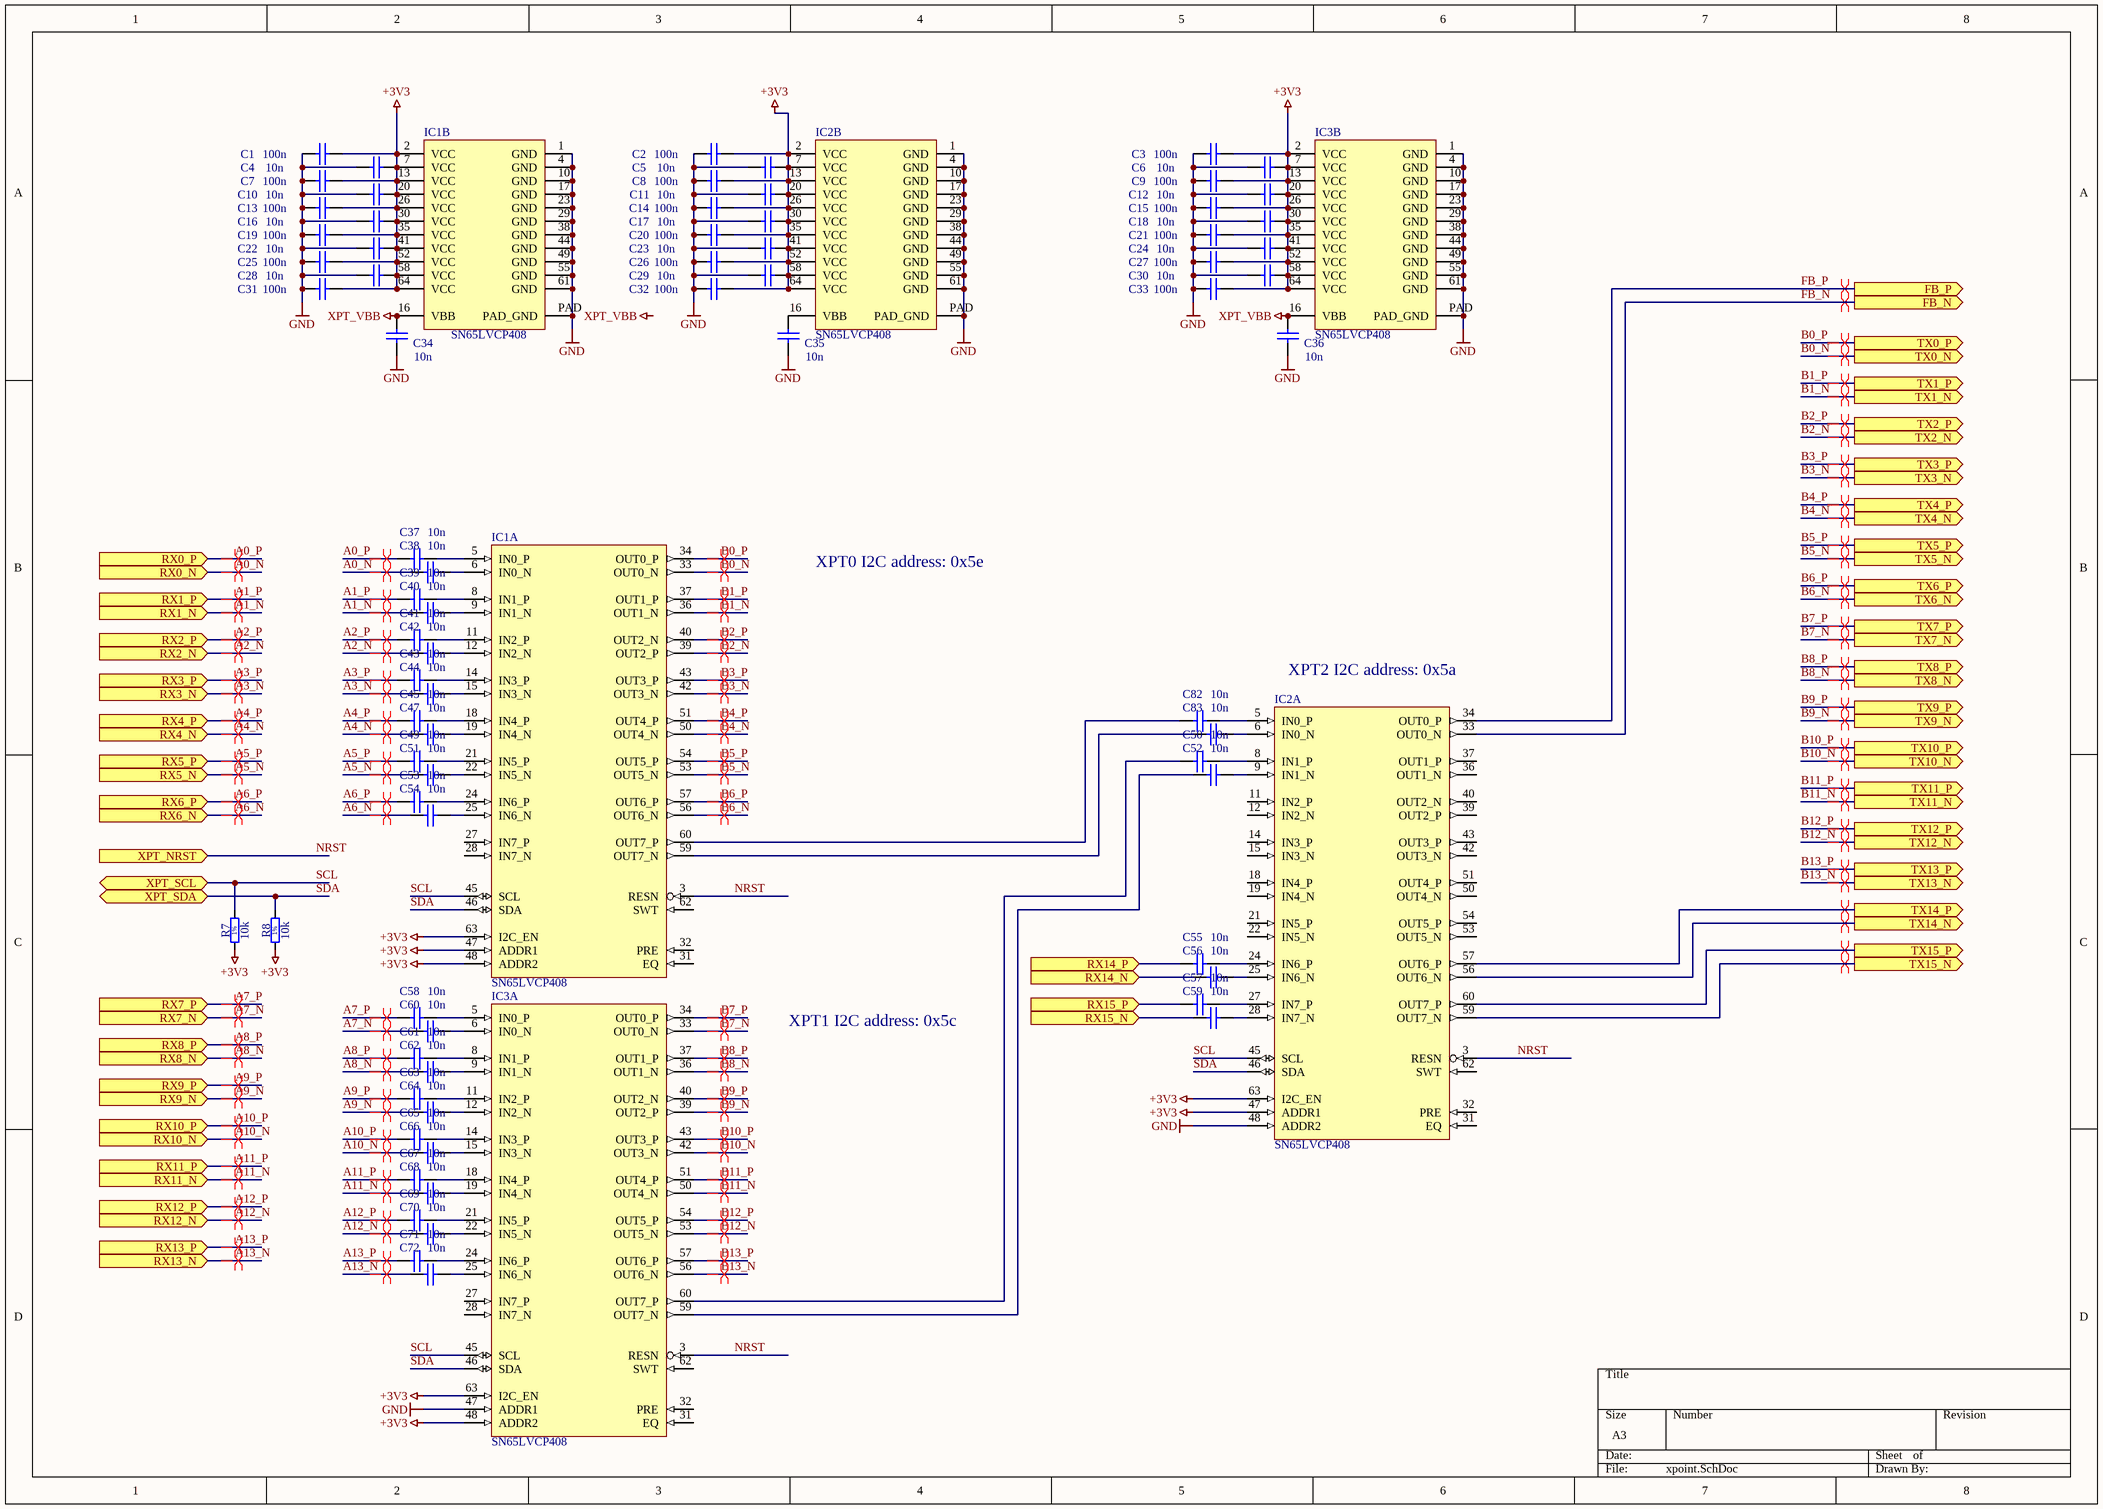
[diagram p3: xpoint.SchDoc]

### Parts
C1  100n  [CAPC1608X87N]
C2  100n  [CAPC1608X87N]
C3  100n  [CAPC1608X87N]
C4  10n  [CAPC1608X87N]
C5  10n  [CAPC1608X87N]
C6  10n  [CAPC1608X87N]
C7  100n  [CAPC1608X87N]
C8  100n  [CAPC1608X87N]
C9  100n  [CAPC1608X87N]
C10  10n  [CAPC1608X87N]
C11  10n  [CAPC1608X87N]
C12  10n  [CAPC1608X87N]
C13  100n  [CAPC1608X87N]
C14  100n  [CAPC1608X87N]
C15  100n  [CAPC1608X87N]
C16  10n  [CAPC1608X87N]
C17  10n  [CAPC1608X87N]
C18  10n  [CAPC1608X87N]
C19  100n  [CAPC1608X87N]
C20  100n  [CAPC1608X87N]
C21  100n  [CAPC1608X87N]
C22  10n  [CAPC1608X87N]
C23  10n  [CAPC1608X87N]
C24  10n  [CAPC1608X87N]
C25  100n  [CAPC1608X87N]
C26  100n  [CAPC1608X87N]
C27  100n  [CAPC1608X87N]
C28  10n  [CAPC1608X87N]
C29  10n  [CAPC1608X87N]
C30  10n  [CAPC1608X87N]
C31  100n  [CAPC1608X87N]
C32  100n  [CAPC1608X87N]
C33  100n  [CAPC1608X87N]
C34  10n  [CAPC1608X87N]
C35  10n  [CAPC1608X87N]
C36  10n  [CAPC1608X87N]
C37  10n  [CAPC1608X87N]
C38  10n  [CAPC1608X87N]
C39  10n  [CAPC1608X87N]
C40  10n  [CAPC1608X87N]
C41  10n  [CAPC1608X87N]
C42  10n  [CAPC1608X87N]
C43  10n  [CAPC1608X87N]
C44  10n  [CAPC1608X87N]
C45  10n  [CAPC1608X87N]
C47  10n  [CAPC1608X87N]
C49  10n  [CAPC1608X87N]
C50  10n  [CAPC1608X87N]
C51  10n  [CAPC1608X87N]
C52  10n  [CAPC1608X87N]
C53  10n  [CAPC1608X87N]
C54  10n  [CAPC1608X87N]
C55  10n  [CAPC1608X87N]
C56  10n  [CAPC1608X87N]
C57  10n  [CAPC1608X87N]
C58  10n  [CAPC1608X87N]
C59  10n  [CAPC1608X87N]
C60  10n  [CAPC1608X87N]
C61  10n  [CAPC1608X87N]
C62  10n  [CAPC1608X87N]
C63  10n  [CAPC1608X87N]
C64  10n  [CAPC1608X87N]
C65  10n  [CAPC1608X87N]
C66  10n  [CAPC1608X87N]
C67  10n  [CAPC1608X87N]
C68  10n  [CAPC1608X87N]
C69  10n  [CAPC1608X87N]
C70  10n  [CAPC1608X87N]
C71  10n  [CAPC1608X87N]
C72  10n  [CAPC1608X87N]
C82  10n  [CAPC1608X87N]
C83  10n  [CAPC1608X87N]
IC1  SN65LVCP408  [HTQFP64]  (parts A,B of 2)
IC2  SN65LVCP408  [HTQFP64]  (parts A,B of 2)
IC3  SN65LVCP408  [HTQFP64]  (parts A,B of 2)
R7  10k  [RESC1608X55N]
R8  10k  [RESC1608X55N]

### Ports
FB_N (out), FB_P (out), RX0_N (in), RX0_P (in), RX1_N (in), RX1_P (in), RX2_N (in), RX2_P (in), RX3_N (in), RX3_P (in), RX4_N (in), RX4_P (in), RX5_N (in), RX5_P (in), RX6_N (in), RX6_P (in), RX7_N (in), RX7_P (in), RX8_N (in), RX8_P (in), RX9_N (in), RX9_P (in), RX10_N (in), RX10_P (in), RX11_N (in), RX11_P (in), RX12_N (in), RX12_P (in), RX13_N (in), RX13_P (in), RX14_N (in), RX14_P (in), RX15_N (in), RX15_P (in), TX0_N (out), TX0_P (out), TX1_N (out), TX1_P (out), TX2_N (out), TX2_P (out), TX3_N (out), TX3_P (out), TX4_N (out), TX4_P (out), TX5_N (out), TX5_P (out), TX6_N (out), TX6_P (out), TX7_N (out), TX7_P (out), TX8_N (out), TX8_P (out), TX9_N (out), TX9_P (out), TX10_N (out), TX10_P (out), TX11_N (out), TX11_P (out), TX12_N (out), TX12_P (out), TX13_N (out), TX13_P (out), TX14_N (out), TX14_P (out), TX15_N (out), TX15_P (out), XPT_NRST (in), XPT_SCL (bidir), XPT_SDA (bidir)

### Nets
+3V3: C1.2 C2.2 C3.2 C4.2 C5.2 C6.2 C7.2 C8.2 C9.2 C10.2 C11.2 C12.2 C13.2 C14.2 C15.2 C16.2 C17.2 C18.2 C19.2 C20.2 C21.2 C22.2 C23.2 C24.2 C25.2 C26.2 C27.2 C28.2 C29.2 C30.2 C31.2 C32.2 C33.2 IC1.2(VCC) IC1.7(VCC) IC1.13(VCC) IC1.20(VCC) IC1.26(VCC) IC1.30(VCC) IC1.35(VCC) IC1.41(VCC) IC1.47(ADDR1) IC1.48(ADDR2) IC1.52(VCC) IC1.58(VCC) IC1.63(I2C_EN) IC1.64(VCC) IC2.2(VCC) IC2.7(VCC) IC2.13(VCC) IC2.20(VCC) IC2.26(VCC) IC2.30(VCC) IC2.35(VCC) IC2.41(VCC) IC2.47(ADDR1) IC2.52(VCC) IC2.58(VCC) IC2.63(I2C_EN) IC2.64(VCC) IC3.2(VCC) IC3.7(VCC) IC3.13(VCC) IC3.20(VCC) IC3.26(VCC) IC3.30(VCC) IC3.35(VCC) IC3.41(VCC) IC3.48(ADDR2) IC3.52(VCC) IC3.58(VCC) IC3.63(I2C_EN) IC3.64(VCC) R7.1 R8.1
GND: C1.1 C2.1 C3.1 C4.1 C5.1 C6.1 C7.1 C8.1 C9.1 C10.1 C11.1 C12.1 C13.1 C14.1 C15.1 C16.1 C17.1 C18.1 C19.1 C20.1 C21.1 C22.1 C23.1 C24.1 C25.1 C26.1 C27.1 C28.1 C29.1 C30.1 C31.1 C32.1 C33.1 C34.1 C35.1 C36.1 IC1.1(GND) IC1.4(GND) IC1.10(GND) IC1.17(GND) IC1.23(GND) IC1.29(GND) IC1.38(GND) IC1.44(GND) IC1.49(GND) IC1.55(GND) IC1.61(GND) IC1.PAD(PAD_GND) IC2.1(GND) IC2.4(GND) IC2.10(GND) IC2.17(GND) IC2.23(GND) IC2.29(GND) IC2.38(GND) IC2.44(GND) IC2.48(ADDR2) IC2.49(GND) IC2.55(GND) IC2.61(GND) IC2.PAD(PAD_GND) IC3.1(GND) IC3.4(GND) IC3.10(GND) IC3.17(GND) IC3.23(GND) IC3.29(GND) IC3.38(GND) IC3.44(GND) IC3.47(ADDR1) IC3.49(GND) IC3.55(GND) IC3.61(GND) IC3.PAD(PAD_GND)
XPT_VBB: C34.2 C36.2 IC1.16(VBB) IC3.16(VBB)
A0_N: C38.1 ; port RX0_N
A0_P: C37.1 ; port RX0_P
A1_N: C40.1 ; port RX1_N
A1_P: C39.1 ; port RX1_P
A2_N: C42.1 ; port RX2_N
A2_P: C41.1 ; port RX2_P
A3_N: C44.1 ; port RX3_N
A3_P: C43.1 ; port RX3_P
A4_N: C47.1 ; port RX4_N
A4_P: C45.1 ; port RX4_P
A5_N: C51.1 ; port RX5_N
A5_P: C49.1 ; port RX5_P
A6_N: C54.1 ; port RX6_N
A6_P: C53.1 ; port RX6_P
A7_N: C60.1 ; port RX7_N
A7_P: C58.1 ; port RX7_P
A8_N: C62.1 ; port RX8_N
A8_P: C61.1 ; port RX8_P
A9_N: C64.1 ; port RX9_N
A9_P: C63.1 ; port RX9_P
A10_N: C66.1 ; port RX10_N
A10_P: C65.1 ; port RX10_P
A11_N: C68.1 ; port RX11_N
A11_P: C67.1 ; port RX11_P
A12_N: C70.1 ; port RX12_N
A12_P: C69.1 ; port RX12_P
A13_N: C72.1 ; port RX13_N
A13_P: C71.1 ; port RX13_P
B0_N: IC1.33(OUT0_N) ; port TX0_N
B0_P: IC1.34(OUT0_P) ; port TX0_P
B1_N: IC1.36(OUT1_N) ; port TX1_N
B1_P: IC1.37(OUT1_P) ; port TX1_P
B2_N: IC1.39(OUT2_P) ; port TX2_N
B2_P: IC1.40(OUT2_N) ; port TX2_P
B3_N: IC1.42(OUT3_N) ; port TX3_N
B3_P: IC1.43(OUT3_P) ; port TX3_P
B4_N: IC1.50(OUT4_N) ; port TX4_N
B4_P: IC1.51(OUT4_P) ; port TX4_P
B5_N: IC1.53(OUT5_N) ; port TX5_N
B5_P: IC1.54(OUT5_P) ; port TX5_P
B6_N: IC1.56(OUT6_N) ; port TX6_N
B6_P: IC1.57(OUT6_P) ; port TX6_P
B7_N: IC3.33(OUT0_N) ; port TX7_N
B7_P: IC3.34(OUT0_P) ; port TX7_P
B8_N: IC3.36(OUT1_N) ; port TX8_N
B8_P: IC3.37(OUT1_P) ; port TX8_P
B9_N: IC3.39(OUT2_P) ; port TX9_N
B9_P: IC3.40(OUT2_N) ; port TX9_P
B10_N: IC3.42(OUT3_N) ; port TX10_N
B10_P: IC3.43(OUT3_P) ; port TX10_P
B11_N: IC3.50(OUT4_N) ; port TX11_N
B11_P: IC3.51(OUT4_P) ; port TX11_P
B12_N: IC3.53(OUT5_N) ; port TX12_N
B12_P: IC3.54(OUT5_P) ; port TX12_P
B13_N: IC3.56(OUT6_N) ; port TX13_N
B13_P: IC3.57(OUT6_P) ; port TX13_P
FB_N: IC2.33(OUT0_N) ; port FB_N
FB_P: IC2.34(OUT0_P) ; port FB_P
NRST: IC1.3(RESN) IC2.3(RESN) IC3.3(RESN) ; port XPT_NRST
SCL: IC1.45(SCL) IC2.45(SCL) IC3.45(SCL) R7.2 ; port XPT_SCL
SDA: IC1.46(SDA) IC2.46(SDA) IC3.46(SDA) R8.2 ; port XPT_SDA
NetC35_2: C35.2 IC2.16(VBB)
NetC37_2: C37.2 IC1.5(IN0_P)
NetC38_2: C38.2 IC1.6(IN0_N)
NetC39_2: C39.2 IC1.8(IN1_P)
NetC40_2: C40.2 IC1.9(IN1_N)
NetC41_2: C41.2 IC1.11(IN2_P)
NetC42_2: C42.2 IC1.12(IN2_N)
NetC43_2: C43.2 IC1.14(IN3_P)
NetC44_2: C44.2 IC1.15(IN3_N)
NetC45_2: C45.2 IC1.18(IN4_P)
NetC47_2: C47.2 IC1.19(IN4_N)
NetC49_2: C49.2 IC1.21(IN5_P)
NetC50_1: C50.1 IC3.60(OUT7_P)
NetC50_2: C50.2 IC2.8(IN1_P)
NetC51_2: C51.2 IC1.22(IN5_N)
NetC52_1: C52.1 IC3.59(OUT7_N)
NetC52_2: C52.2 IC2.9(IN1_N)
NetC53_2: C53.2 IC1.24(IN6_P)
NetC54_2: C54.2 IC1.25(IN6_N)
NetC55_1: C55.1 ; port RX14_P
NetC55_2: C55.2 IC2.24(IN6_P)
NetC56_1: C56.1 ; port RX14_N
NetC56_2: C56.2 IC2.25(IN6_N)
NetC57_1: C57.1 ; port RX15_P
NetC57_2: C57.2 IC2.27(IN7_P)
NetC58_2: C58.2 IC3.5(IN0_P)
NetC59_1: C59.1 ; port RX15_N
NetC59_2: C59.2 IC2.28(IN7_N)
NetC60_2: C60.2 IC3.6(IN0_N)
NetC61_2: C61.2 IC3.8(IN1_P)
NetC62_2: C62.2 IC3.9(IN1_N)
NetC63_2: C63.2 IC3.11(IN2_P)
NetC64_2: C64.2 IC3.12(IN2_N)
NetC65_2: C65.2 IC3.14(IN3_P)
NetC66_2: C66.2 IC3.15(IN3_N)
NetC67_2: C67.2 IC3.18(IN4_P)
NetC68_2: C68.2 IC3.19(IN4_N)
NetC69_2: C69.2 IC3.21(IN5_P)
NetC70_2: C70.2 IC3.22(IN5_N)
NetC71_2: C71.2 IC3.24(IN6_P)
NetC72_2: C72.2 IC3.25(IN6_N)
NetC82_1: C82.1 IC1.60(OUT7_P)
NetC82_2: C82.2 IC2.5(IN0_P)
NetC83_1: C83.1 IC1.59(OUT7_N)
NetC83_2: C83.2 IC2.6(IN0_N)
NetIC2_56: IC2.56(OUT6_N) ; port TX14_N
NetIC2_57: IC2.57(OUT6_P) ; port TX14_P
NetIC2_59: IC2.59(OUT7_N) ; port TX15_N
NetIC2_60: IC2.60(OUT7_P) ; port TX15_P

Not connected (* = marked no-connect by the designer): IC1 27(IN7_P) 28(IN7_N) 31(EQ) 32(PRE) 62(SWT); IC2 11(IN2_P) 12(IN2_N) 14(IN3_P) 15(IN3_N) 18(IN4_P) 19(IN4_N) 21(IN5_P) 22(IN5_N) 31(EQ) 32(PRE) 36(OUT1_N) 37(OUT1_P) 39(OUT2_P) 40(OUT2_N) 42(OUT3_N) 43(OUT3_P) 50(OUT4_N) 51(OUT4_P) 53(OUT5_N) 54(OUT5_P) 62(SWT); IC3 27(IN7_P) 28(IN7_N) 31(EQ) 32(PRE) 62(SWT)

### Layout directives
differential pair: A0_N, A0_P, A1_N, A1_P, A2_N, A2_P, A3_N, A3_P, A4_N, A4_P, A5_N, A5_P, A6_N, A6_P, A7_N, A7_P, A8_N, A8_P, A9_N, A9_P, A10_N, A10_P, A11_N, A11_P, A12_N, A12_P, A13_N, A13_P, B0_N, B0_P, B1_N, B1_P, B2_N, B2_P, B3_N, B3_P, B4_N, B4_P, B5_N, B5_P, B6_N, B6_P, B7_N, B7_P, B8_N, B8_P, B9_N, B9_P, B10_N, B10_P, B11_N, B11_P, B12_N, B12_P, B13_N, B13_P, FB_N, FB_P, NetIC2_56, NetIC2_57, NetIC2_59, NetIC2_60

### Notes on the sheet
- XPT0 I2C address: 0x5e
- (near IC2) XPT2 I2C address: 0x5a
- XPT1 I2C address: 0x5c
- Labels drawn without touching a wire or pin: XPT_VBB
- (in symbol R0603_10K_1%_0.1W_100PPM) 1%

### Library data of the parts
C1-C3 C7-C9 C13-C15 C19-C21 C25-C27 C31-C33 = CC0603_100NF_50V_10%_X7R: Non-polarised capacitor; Part Description: SMD Multilayer Chip Ceramic Capacitor; Manufacturer: GENERIC; Manufacturer1 Part Number: 223858615649; Value: 100nF; Voltage: 50V; TC: X7R; Tolerance: ±10%; Table: Capacitors SMD; Part Number: CC0603_100NF_50V_10%_X7R; Component Kind: Standard; Component Type: Standard; Pin Count: 2; Status: Preferred; Manufacturer Part Number: CC0603_100NF_50V_10%_X7R; Case: 0603; Mounted: Yes; Socket: No; SMD: Yes; Manufacturer1 Example: PHYCOMP; Manufacturer1 ComponentHeight: 0.87mm; HelpURL: \\cern.ch\dfs\Applications\Altium\Datasheets\CC0603_X7R_PHYCOMP.pdf; Author: CERN DEM JLC; CreateDate: 12/3/2007; LatestRevisionDate: 12/3/2007
C4-C6 C10-C12 C16-C18 C22-C24 C28-C30 C34-C45 C47 C49-C72 C82 C83 = CC0603_10NF_50V_10%_X7R: as C46 on sheet mini_backplane; Part Number: CC0603_10NF_50V_10%_X7R; Component Kind: Standard; Component Type: Standard; Pin Count: 2; Status: Preferred; Manufacturer Part Number: CC0603_10NF_50V_10%_X7R; Case: 0603; Mounted: Yes; Socket: No; SMD: Yes; Manufacturer1 Example: PHYCOMP; Manufacturer1 ComponentHeight: 0.87mm; HelpURL: \\cern.ch\dfs\Applications\Altium\Datasheets\CC0603_X7R_PHYCOMP.pdf; Author: CERN DEM JLC; CreateDate: 12/3/2007; LatestRevisionDate: 12/3/2007
IC1-IC3 = SN65LVCP408: TI 8x8 gigabit crosspoint
R7 R8 = R0603_10K_1%_0.1W_100PPM: as R21 on sheet sfp_wrapper; Part Number: R0603_10K_1%_0.1W_100PPM; Component Kind: Standard; Component Type: Standard; Pin Count: 2; Value: 10k; Status: Preferred; Tolerance: ±1%; Manufacturer Part Number: R0603_10K_1%_0.1W_100PPM; Case: 0603; Mounted: Yes; Socket: No; SMD: Yes; Manufacturer1 Example: NIC COMPONENT; Manufacturer1 ComponentHeight: 0.55mm; HelpURL: \\cern.ch\dfs\Applications\Altium\Datasheets\R0603_NIC_NRC.pdf; Author: CERN DEM JLC; CreateDate: 12/3/2007; LatestRevisionDate: 3/13/2008

## Nets that join several sheets
+3V3: SFP_DP0 (17 pins), SFP_DP1 (17 pins), SFP_DP2 (17 pins), SFP_DP3 (17 pins), SFP_DP4 (17 pins), SFP_DP5 (17 pins), SFP_DP6 (17 pins), SFP_DP7 (17 pins), i2c_stuff (C75.2 IC4.24 R3.2 R4.2), xpoint (75 pins)
GND: mini_backplane (83 pins), SFP_DP0 (33 pins), SFP_DP1 (33 pins), SFP_DP2 (33 pins), SFP_DP3 (33 pins), SFP_DP4 (33 pins), SFP_DP5 (33 pins), SFP_DP6 (33 pins), SFP_DP7 (33 pins), i2c_stuff (5 pins), xpoint (74 pins)
I2C_NRST: mini_backplane (CN1.106), i2c_stuff (IC4.3)
SCL_AUX: mini_backplane (CN1.56), i2c_stuff (IC4.22 R3.1)
SDA_AUX: mini_backplane (CN1.71), i2c_stuff (IC4.23 R4.1)